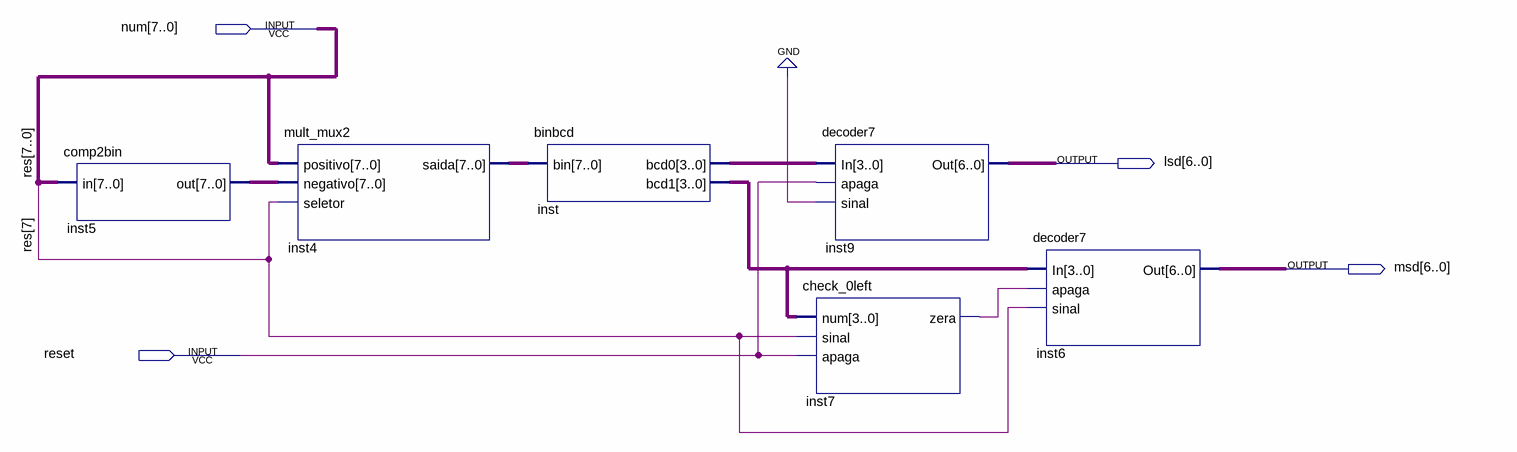
[diagram p0: schematic sheet]
// Quartus schematic out_num.bdf as structural Verilog: 6 symbols, 4 pins
module out_num (
  input  [7:0] num,
  input  reset,
  output [6:0] lsd,
  output [6:0] msd
);

  wire inst7_zera;
  wire [3:0] inst_bcd0, inst_bcd1;
  wire [7:0] inst4_saida, inst5_out;

  comp2bin inst5 (.in(num), .out(inst5_out));
  mult_mux2 inst4 (.positivo(num), .negativo(inst5_out), .seletor(num[7]), .saida(inst4_saida));
  binbcd inst (.bin(inst4_saida), .bcd0(inst_bcd0), .bcd1(inst_bcd1));
  decoder7 inst9 (.In(inst_bcd0), .apaga(reset), .sinal(1'b0), .Out(lsd));
  check_0left inst7 (.num(inst_bcd1), .sinal(num[7]), .apaga(reset), .zera(inst7_zera));
  decoder7 inst6 (.In(inst_bcd1), .apaga(inst7_zera), .sinal(num[7]), .Out(msd));

  // Other names for the same wires on the sheet: res[7:0] = num
endmodule
